# EAGLE schematic placa_v1 (EAGLE 7.2.0)
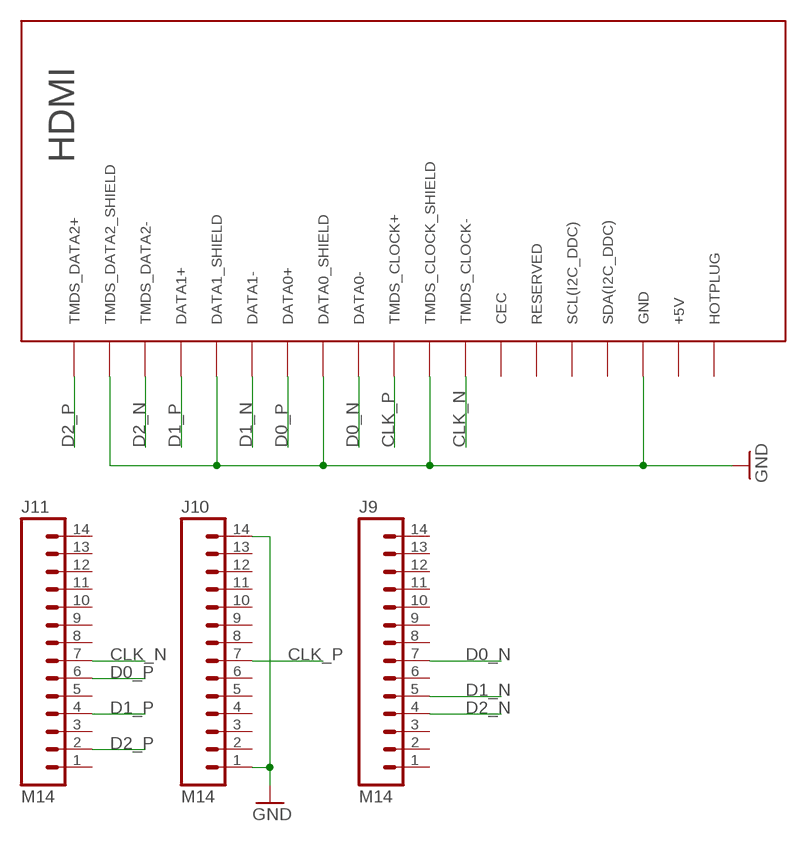
[diagram p0: schematic, sheet 1]

## Parts
J9  M14  [1X14]
J10  M14  [1X14]
J11  M14  [1X14]
U$1  HDMI  [HDMI]

## Nets
CLK_N: J11.7 U$1.P$8(TMDS_CLOCK-)
CLK_P: J10.7 U$1.P$10(TMDS_CLOCK+)
D0_N: J9.7 U$1.P$11(DATA0-)
D0_P: J11.6 U$1.P$13(DATA0+)
D1_N: J9.5 U$1.P$14(DATA1-)
D1_P: J11.4 U$1.P$16(DATA1+)
D2_N: J9.4 U$1.P$17(TMDS_DATA2-)
D2_P: J11.2 U$1.P$19(TMDS_DATA2+)
GND [power]: J10.1 J10.14 U$1.P$3(GND) U$1.P$9(TMDS_CLOCK_SHIELD) U$1.P$12(DATA0_SHIELD) U$1.P$15(DATA1_SHIELD) U$1.P$18(TMDS_DATA2_SHIELD)
Unconnected: J9.1 J9.2 J9.3 J9.6 J9.8 J9.9 J9.10 J9.11 J9.12 J9.13 J9.14 J10.2 J10.3 J10.4 J10.5 J10.6 J10.8 J10.9 J10.10 J10.11 J10.12 J10.13 J11.1 J11.3 J11.5 J11.8 J11.9 J11.10 J11.11 J11.12 J11.13 J11.14 U$1.P$1(HOTPLUG) U$1.P$2(+5V) U$1.P$4(SDA(I2C_DDC)) U$1.P$5(SCL(I2C_DDC)) U$1.P$6(RESERVED) U$1.P$7(CEC)

## Library data of the parts
J9-J11 = SparkFun:M14: Header 14 Standard 14-pin 0.1" header. Use with straight break away headers (SKU : PRT-00116), right angle break away headers (PRT-00553), swiss pins (PRT-00743), machine pins (PRT-00117), and female headers (PRT-00115).
U$1 = 00_cody:HDMI

## Net classes
0 default: width 0.203 mm, clearance 0.203 mm
1 power: width 0.406 mm, clearance 0.203 mm to class 0, clearance 0.203 mm